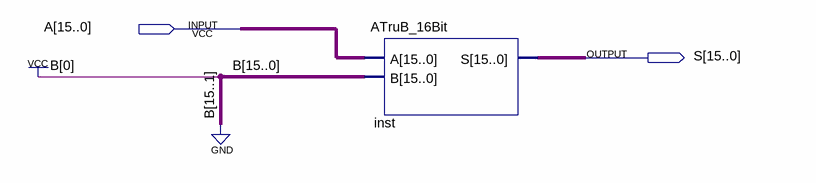
[diagram p0: schematic sheet]
// Quartus schematic ATru1_16Bit.bdf as structural Verilog: 1 symbols, 2 pins
module ATru1_16Bit (
  input  [15:0] A,
  output [15:0] S
);

  ATruB_16Bit inst (.A(A), .B(16'b0000000000000001), .S(S));
endmodule
